# EAGLE design Test Arduino Shield (EAGLE 7.7.0)
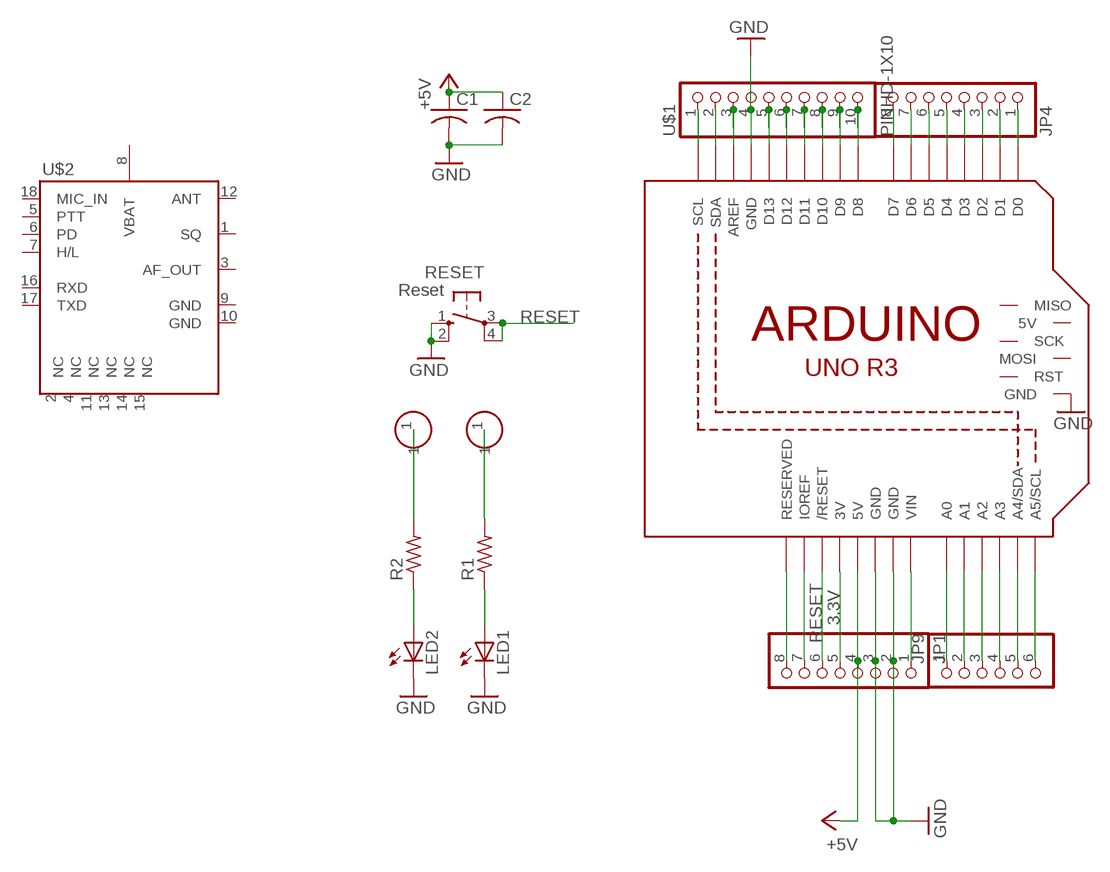
[diagram p0: schematic, sheet 1]

## Parts
C1  C-US025-025X050  [C025-025X050]
C2  C-US025-025X050  [C025-025X050]
JP1  PINHD-1X8BIG  [1X08-BIG]
JP4  PINHD-1X8BIG  [1X08-BIG]
JP9  PINHD-1X6B  [1X06-BIG]
LED1  LED3MM  [LED3MM]
LED2  LED3MM  [LED3MM]
M1  ARDUINO_R3_ICSP  [ARDUINOR3_ICSP]
R1  R-US_0207/5V  [0207/5V]
R2  R-US_0207/5V  [0207/5V]
RESET  Reset  10-XX  [B3F-10XX]
U$1  PINHD-1X10  [1X10-BIG]
U$2  DRA818A  [DRA818A]
U$4  PERFHOLE  [PERFHOLE]
U$7  PERFHOLE  [PERFHOLE]

## Nets
3.3V: JP1.5 M1.3V
+5V: C1.1 C2.1 JP1.4 M1.5V
GND: C1.2 C2.2 JP1.2 JP1.3 LED1.K(C) LED2.K(C) M1.GND M1.GND@1(GND) M1.GND@2(GND) M1.GND@3(GND) RESET.1(S) RESET.2(S1) U$1.4
N$2: M1.AREF U$1.3
N$4: JP1.8 M1.RESERVED
N$5: M1.D13 U$1.5
N$8: LED1.A R1.1
N$15: JP1.7 M1.IOREF
N$16: R1.2 U$7.1
N$40: R2.2 U$4.1
N$41: LED2.A R2.1
N$45: M1.D12 U$1.6
N$54: M1.D11 U$1.7
N$55: M1.D10 U$1.8
N$56: M1.D9 U$1.9
N$57: M1.D8 U$1.10
N$58: JP9.1 M1.A0
N$59: JP9.2 M1.A1
N$70: JP9.3 M1.A2
N$88: JP9.4 M1.A3
N$89: JP9.5 M1.A4(A4/SDA)
N$92: JP9.6 M1.A5(A5/SCL)
N$93: JP4.1 M1.D0
N$94: JP4.2 M1.D1
N$115: JP4.3 M1.D2
N$116: JP4.4 M1.D3
N$117: JP4.5 M1.D4
N$135: JP4.6 M1.D5
N$145: JP4.7 M1.D6
N$152: JP4.8 M1.D7
N$153: JP1.1 M1.VIN
N$154: M1.SCL U$1.1
N$164: M1.SDA U$1.2
RESET: JP1.6 M1.RESET(/RESET) RESET.3(P) RESET.4(P1)
Unconnected: M1.5V_ICSP(5V) M1.MISO M1.MOSI M1.RESET_ICSP(RST) M1.SCK U$2.1(SQ) U$2.2(NC) U$2.3(AF_OUT) U$2.4(NC) U$2.5(PTT) U$2.6(PD) U$2.7(H/L) U$2.8(VBAT) U$2.9(GND) U$2.10(GND) U$2.11(NC) U$2.12(ANT) U$2.13(NC) U$2.14(NC) U$2.15(NC) U$2.16(RXD) U$2.17(TXD) U$2.18(MIC_IN)

## Library data of the parts
C1 C2 = rcl-ez:C-US: CAPACITOR, American symbol
JP1 JP4 = carduino:PINHD-1X8: PIN HEADER
JP9 = carduino:PINHD-1X6: PIN HEADER
LED1 LED2 = adafruit:LED: LED OSRAM: - CHIPLED LG R971, LG N971, LY N971, LG Q971, LY Q971, LO R971, LY R971 LH N974, LH R974 LS Q976, LO Q976, LY Q976 LO Q996 - Hyper CHIPLED LW Q18S LB Q993, LB Q99A, LB R99A - SideLED LS A670, LO A670, LY A670, LG A670, LP A670 LB A673, LV A673, LT A673, LW A673 LH A674 LY A675 LS A676, LA A676, LO A676, LY A676, LW A676 LS A679, LY A679, LG A679 - Hyper Micro SIDELED® LS Y876, LA Y876, LO Y876, LY Y876 LT Y87S - SmartLED LW L88C, LW L88S LB L89C, LB L89S, LG L890 LS L89K, LO L89K, LY L89K LS L896, LA L896, LO L896, LY L896 - TOPLED LS T670, LO T670, LY T670, LG T670, LP T670 LSG T670, LSP T670, LSY T670, LOP T670, LYG T670 LG T671, LOG T671, LSG T671 LB T673, LV T673, LT T673, LW T673 LH T674 LS T676, LA T676, LO T676, LY T676, LB T676, LH T676, LSB T676, LW T676 LB T67C, LV T67C, LT T67C, LS T67K, LO T67K, LY T67K, LW E67C LS E67B, LA E67B, LO E67B, LY E67B, LB E67C, LV E67C, LT E67C LW T67C LS T679, LY T679, LG T679 LS T770, LO T770, LY T770, LG T770, LP T770 LB T773, LV T773, LT T773, LW T773 LH T774 LS E675, LA E675, LY E675, LS T675 LS T776, LA T776, LO T776, LY T776, LB T776 LHGB T686 LT T68C, LB T68C - Hyper Mini TOPLED® LB M676 - Mini TOPLED Santana® LG M470 LS M47K, LO M47K, LY M47K Source: http://www.osram.convergy.de/
M1 = adafruit:ARDUINO_R3_ICSP
R1 R2 = rcl-ez:R-US_: RESISTOR, American symbol
RESET = switch-omron:10-XX: OMRON SWITCH; MPN: B3F-1000; OC_FARNELL: 176432; OC_NEWARK: 36M3542
U$1 = adafruit:PINHD-1X10: Pin header 1x10 0.1" spacing With round pins
U$2 = dorji:DRA818A
U$4 U$7 = Atmex:PERFHOLE

## Board
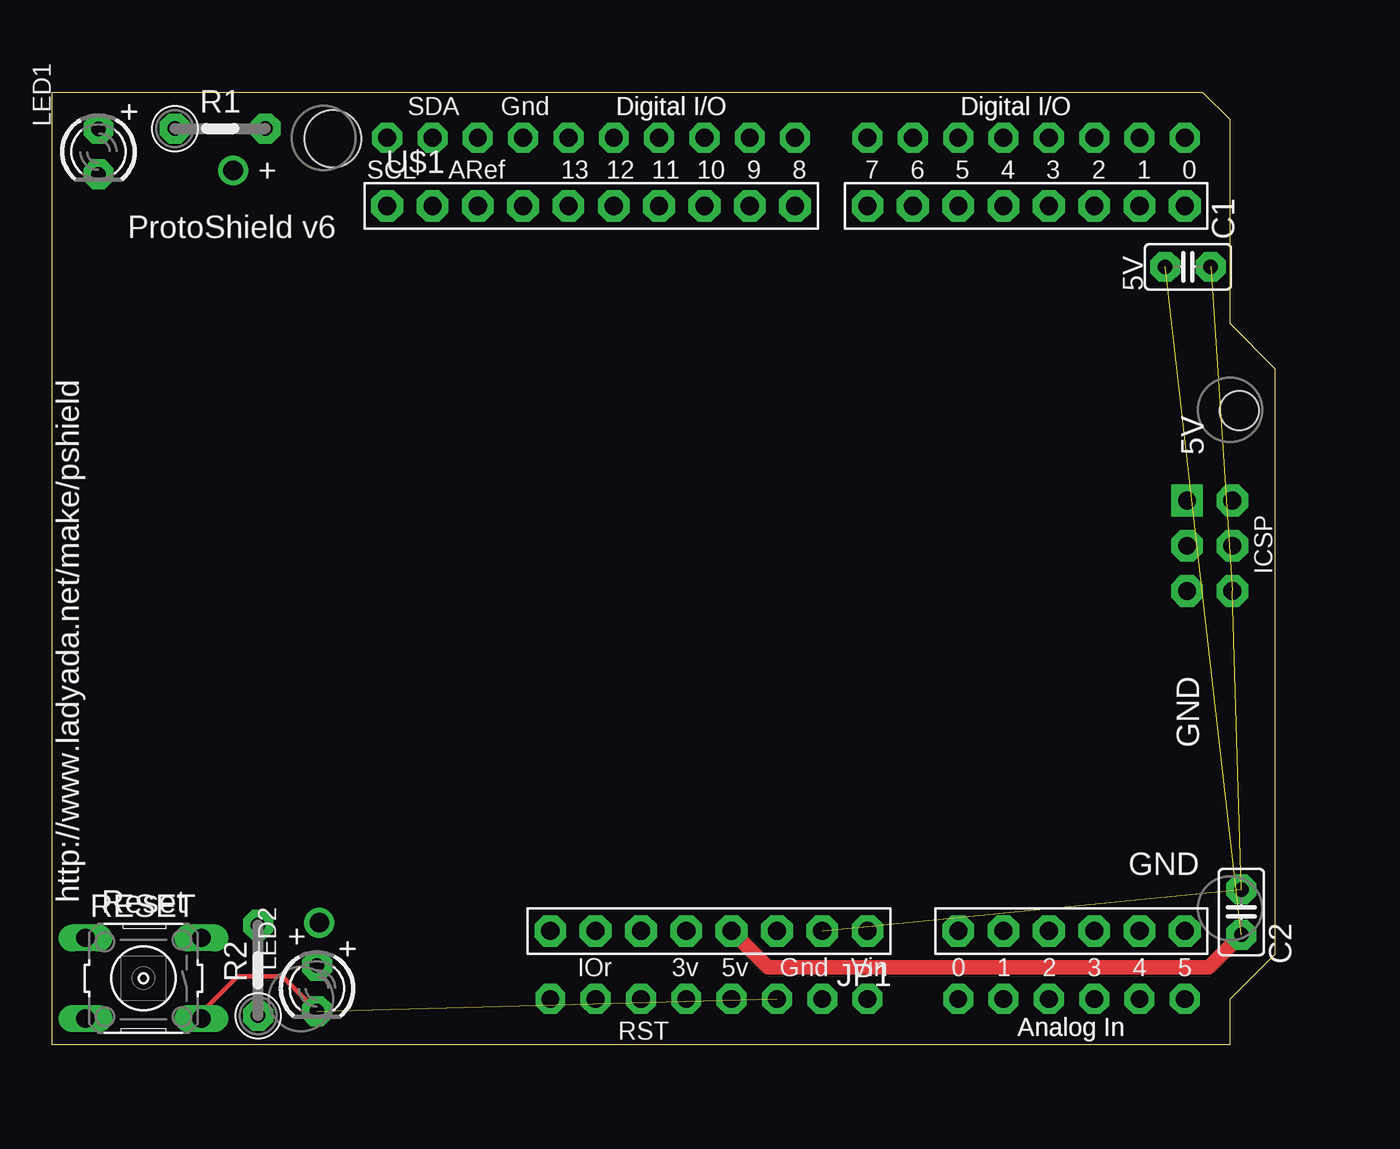
[diagram p1: board, top side]
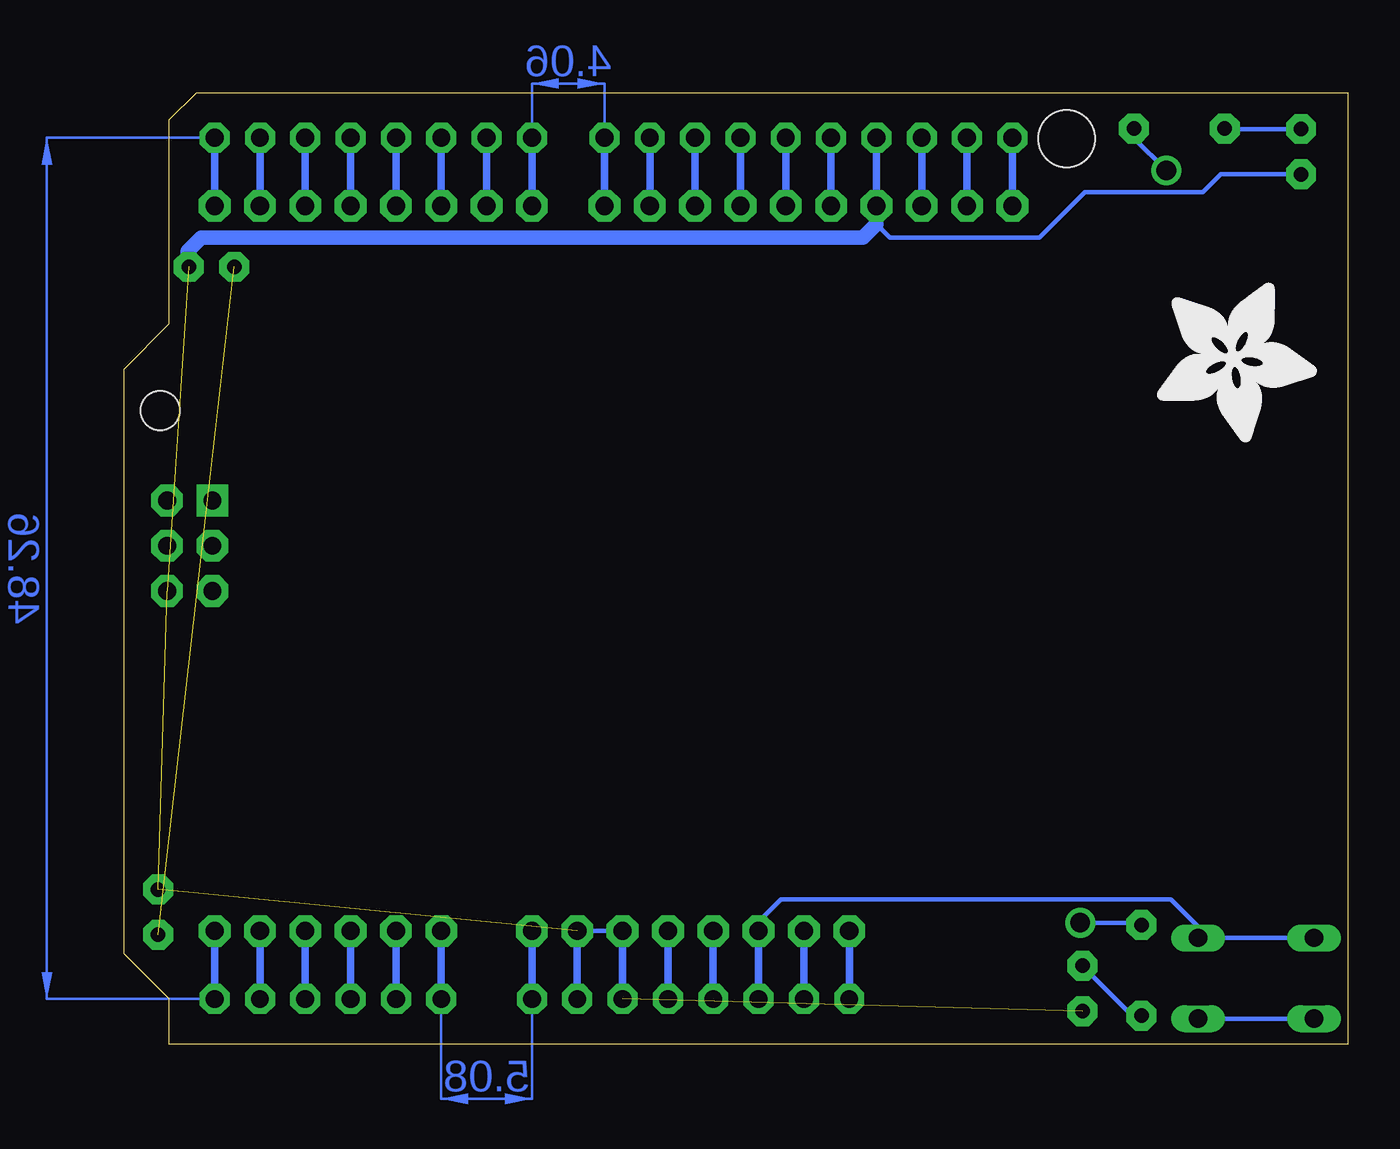
[diagram p2: board, bottom side, seen from below]

Size 68.58 x 53.34 mm. Coordinates in mm from the lower left corner, seen from the top.
Copper layers (1*16): Top 0.035mm / dielectric 1.5mm / Bottom 0.035mm
Design rules "adafruit": minimum track width 8mil, minimum drill 15.5mil, track to track 8mil, track to pad 8mil, pad to pad 8mil, via to via 8mil, smd to smd 8mil, copper to edge 10mil, drill to drill 8mil, minimum pad ring 10mil, minimum via ring 8mil, stop-mask expansion 2mil, vias tented up to drill 20mil, thermal gap 10mil
Holes 3.2 mm at 15.76,50.75
Holes 2.2 mm at 66.56,35.51

### Footprints (pad centres in the part's own frame; a part is rotated, then mirrored left to right if it is on the bottom)
C025-025X050 = drill 0.813 pad 1.676 octagon: 1 -1.27,0; 2 1.27,0
1X08-BIG = drill 1.016 pad 1.778 octagon: 1 -8.89,0; 2 -6.35,0; 3 -3.81,0; 4 -1.27,0; 5 1.27,0; 6 3.81,0; 7 6.35,0; 8 8.89,0
1X06-BIG = drill 1.016 pad 1.778 octagon: 1 -6.35,0; 2 -3.81,0; 3 -1.27,0; 4 1.27,0; 5 3.81,0; 6 6.35,0
LED3MM = drill 0.813 pad 1.676 octagon: A -1.27,0; K 1.27,0
ARDUINOR3_ICSP = drill 1 pad 1.676 octagon: 3V 35.56,2.54; 5V 38.1,2.54; A0 50.8,2.54; A1 53.34,2.54; A2 55.88,2.54; A3 58.42,2.54; A4 60.96,2.54; A5 63.5,2.54; AREF 23.876,50.8; D0 63.5,50.8; D1 60.96,50.8; D2 58.42,50.8; D3 55.88,50.8; D4 53.34,50.8; D5 50.8,50.8; D6 48.26,50.8; D7 45.72,50.8; D8 41.656,50.8; D9 39.116,50.8; D10 36.576,50.8; D11 34.036,50.8; D12 31.496,50.8; D13 28.956,50.8; GND 26.416,50.8; GND@1 43.18,2.54; GND@2 40.64,2.54; IOREF 30.48,2.54; RESERVED 27.94,2.54; RESET 33.02,2.54; SCL 18.796,50.8; SDA 21.336,50.8; VIN 45.72,2.54 | drill 1 pad 1.778 octagon: 5V_ICSP 66.167,30.48; GND@3 66.167,25.4; MOSI 66.167,27.94; RESET_ICSP 63.627,25.4; SCK 63.627,27.94 | drill 1 pad 1.778 square: MISO 63.627,30.48
0207/5V = drill 0.813 pad 1.676 octagon: 1 -2.54,0; 2 2.54,0
B3F-10XX = drill 1.016 long: 1 -3.251,2.261; 2 3.251,2.261; 3 -3.251,-2.261; 4 3.251,-2.261
1X10-BIG = drill 1.016 pad 1.778 octagon: 1 -11.43,0; 2 -8.89,0; 3 -6.35,0; 4 -3.81,0; 5 -1.27,0; 6 1.27,0; 7 3.81,0; 8 6.35,0; 9 8.89,0; 10 11.43,0
DRA818A = smd 3.81 x 1.93: 1 -9.45,-13.25; 2 -9.45,-8.8; 3 -9.45,-4.35; 4 -9.45,0.1; 5 -9.45,4.55; 6 -9.45,9; 7 -9.45,13.45; 12 9.65,13.45; 13 9.65,9; 14 9.65,4.55; 15 9.65,0.1; 16 9.6,-4.35; 17 9.65,-8.8; 18 9.65,-13.25 | smd 1.93 x 3.81: 8 -6.8,17.95; 9 -2.2,17.95; 10 2.4,17.95; 11 7,17.95
PERFHOLE = drill 1.1 pad 1.676: 1 0,0

### Placement (x,y rotation side)
C1  63.67,43.57 0 top
C2  66.66,7.41 90 top
JP1  36.83,6.35 180 top
JP4  54.61,46.99 180 top
JP9  57.15,6.35 0 top
LED1  2.62,50.03 270 top
LED2  14.87,3.13 270 top
M1  0,0 0 top
R1  9.44,51.32 0 top
R2  11.57,4.15 90 top
RESET  5.14,3.7 180 top
U$1  30.23,46.99 0 top
U$2  -18.03,30.48 180 top  (outside the outline)
U$4  15,6.81 0 top
U$7  10.17,48.98 0 top
U$36  [ADAFRUIT_9MM]  10.67,42.67 270 bottom

### Tracks (layer width: path | path; a pad name or v marks a point on that pad's centre or on a via)
3.3V
  Bottom 0.406: JP1.5 M1.3V
+5V  (1 unrouted)
  Top 0.813: JP1.4 40.13,4.32 64.84,4.32 C2.1
  Bottom 0.406: JP1.4 M1.5V
GND  (4 unrouted)
  Top 0.254: RESET.1 8.39,1.79 10.41,3.81 12.92,3.81 LED2.K
  Bottom 0.254: RESET.2 RESET.1 | JP1.3 JP1.2 | LED1.K 7.12,48.76 8.13,47.75 14.73,47.75 17.27,45.21 25.65,45.21 26.42,45.97 U$1.4
  Bottom 0.406: M1.GND U$1.4 | M1.GND@2 JP1.3 | JP1.2 M1.GND@1
  Bottom 0.813: 26.42,45.97 27.18,45.21 64.26,45.21 65.02,44.45 65.02,43.65 C1.2
N$2
  Bottom 0.406: U$1.3 M1.AREF
N$4
  Bottom 0.406: JP1.8 M1.RESERVED
N$5
  Bottom 0.406: M1.D13 U$1.5
N$8
  Bottom 0.254: LED1.A 6.88,51.3 R1.1
N$15
  Bottom 0.406: M1.IOREF JP1.7
N$16
  Bottom 0.254: R1.2 11.98,50.79 U$7.1
N$40
  Bottom 0.254: U$4.1 11.69,6.81 R2.2
N$41
  Bottom 0.254: R2.1 12.07,1.6 LED2.A
N$45
  Bottom 0.406: U$1.6 M1.D12
N$54
  Bottom 0.406: M1.D11 U$1.7
N$55
  Bottom 0.406: U$1.8 M1.D10
N$56
  Bottom 0.406: M1.D9 U$1.9
N$57
  Bottom 0.406: U$1.10 M1.D8
N$58
  Bottom 0.406: JP9.1 M1.A0
N$59
  Bottom 0.406: M1.A1 JP9.2
N$70
  Bottom 0.406: JP9.3 M1.A2
N$88
  Bottom 0.406: M1.A3 JP9.4
N$89
  Bottom 0.406: JP9.5 M1.A4
N$92
  Bottom 0.406: M1.A5 JP9.6
N$93
  Bottom 0.406: M1.D0 JP4.1
N$94
  Bottom 0.406: M1.D1 JP4.2
N$115
  Bottom 0.406: M1.D2 JP4.3
N$116
  Bottom 0.406: M1.D3 JP4.4
N$117
  Bottom 0.406: M1.D4 JP4.5
N$135
  Bottom 0.406: M1.D5 JP4.6
N$145
  Bottom 0.406: JP4.7 M1.D6
N$152
  Bottom 0.406: M1.D7 JP4.8
N$153
  Bottom 0.406: M1.VIN JP1.1
N$154
  Bottom 0.406: M1.SCL U$1.1
N$164
  Bottom 0.406: M1.SDA U$1.2
RESET
  Bottom 0.254: RESET.4 RESET.3 8.39,6.61 9.91,8.13 31.75,8.13 33.02,6.86 JP1.6
  Bottom 0.406: JP1.6 M1.RESET
(copper drawn outside any net)
  shapes: Bottom area x3

### Text on the board
tPlace: Digital I/O | Digital I/O | + | ProtoShield v6 | 5V | 5V | ICSP | GND | GND | http://www.ladyada.net/make/pshield | Reset | + | Analog In